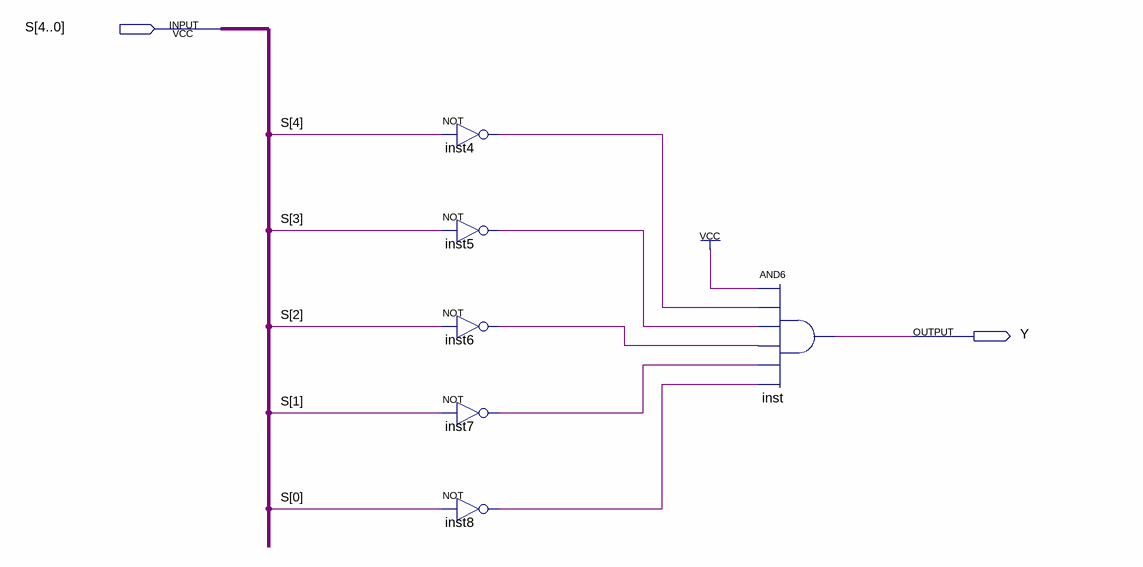
[diagram p0: schematic sheet]
// Quartus schematic S0.bdf as structural Verilog: 6 symbols, 2 pins
module S0 (
  input  [4:0] S,
  output Y
);

  wire inst4_out, inst5_out, inst6_out, inst7_out, inst8_out;

  not inst4 (inst4_out, S[4]);
  not inst5 (inst5_out, S[3]);
  not inst6 (inst6_out, S[2]);
  not inst7 (inst7_out, S[1]);
  not inst8 (inst8_out, S[0]);
  and inst (Y, 1'b1, inst4_out, inst5_out, inst6_out, inst7_out, inst8_out);
endmodule
